# Altium schematic sheet CW6655H QFN48 BLE SDK V1.01.SchDoc
size A3; PageSetup: Record=PageOptions|CenterHorizontal=True|CenterVertical=True|PrintScale=0.69|XCorrection=1.00|YCorrection=1.00|PrintKind=0|BorderSize=5000000|LeftOffset=0|BottomOffset=0|Orientation=2|PaperLength=1000|PaperWidth=1000|Scale=100|PaperSource=7|PrintQuality=-4|MediaType=1|DitherType=10|PaperKind=A4|PrintScaleMode=1
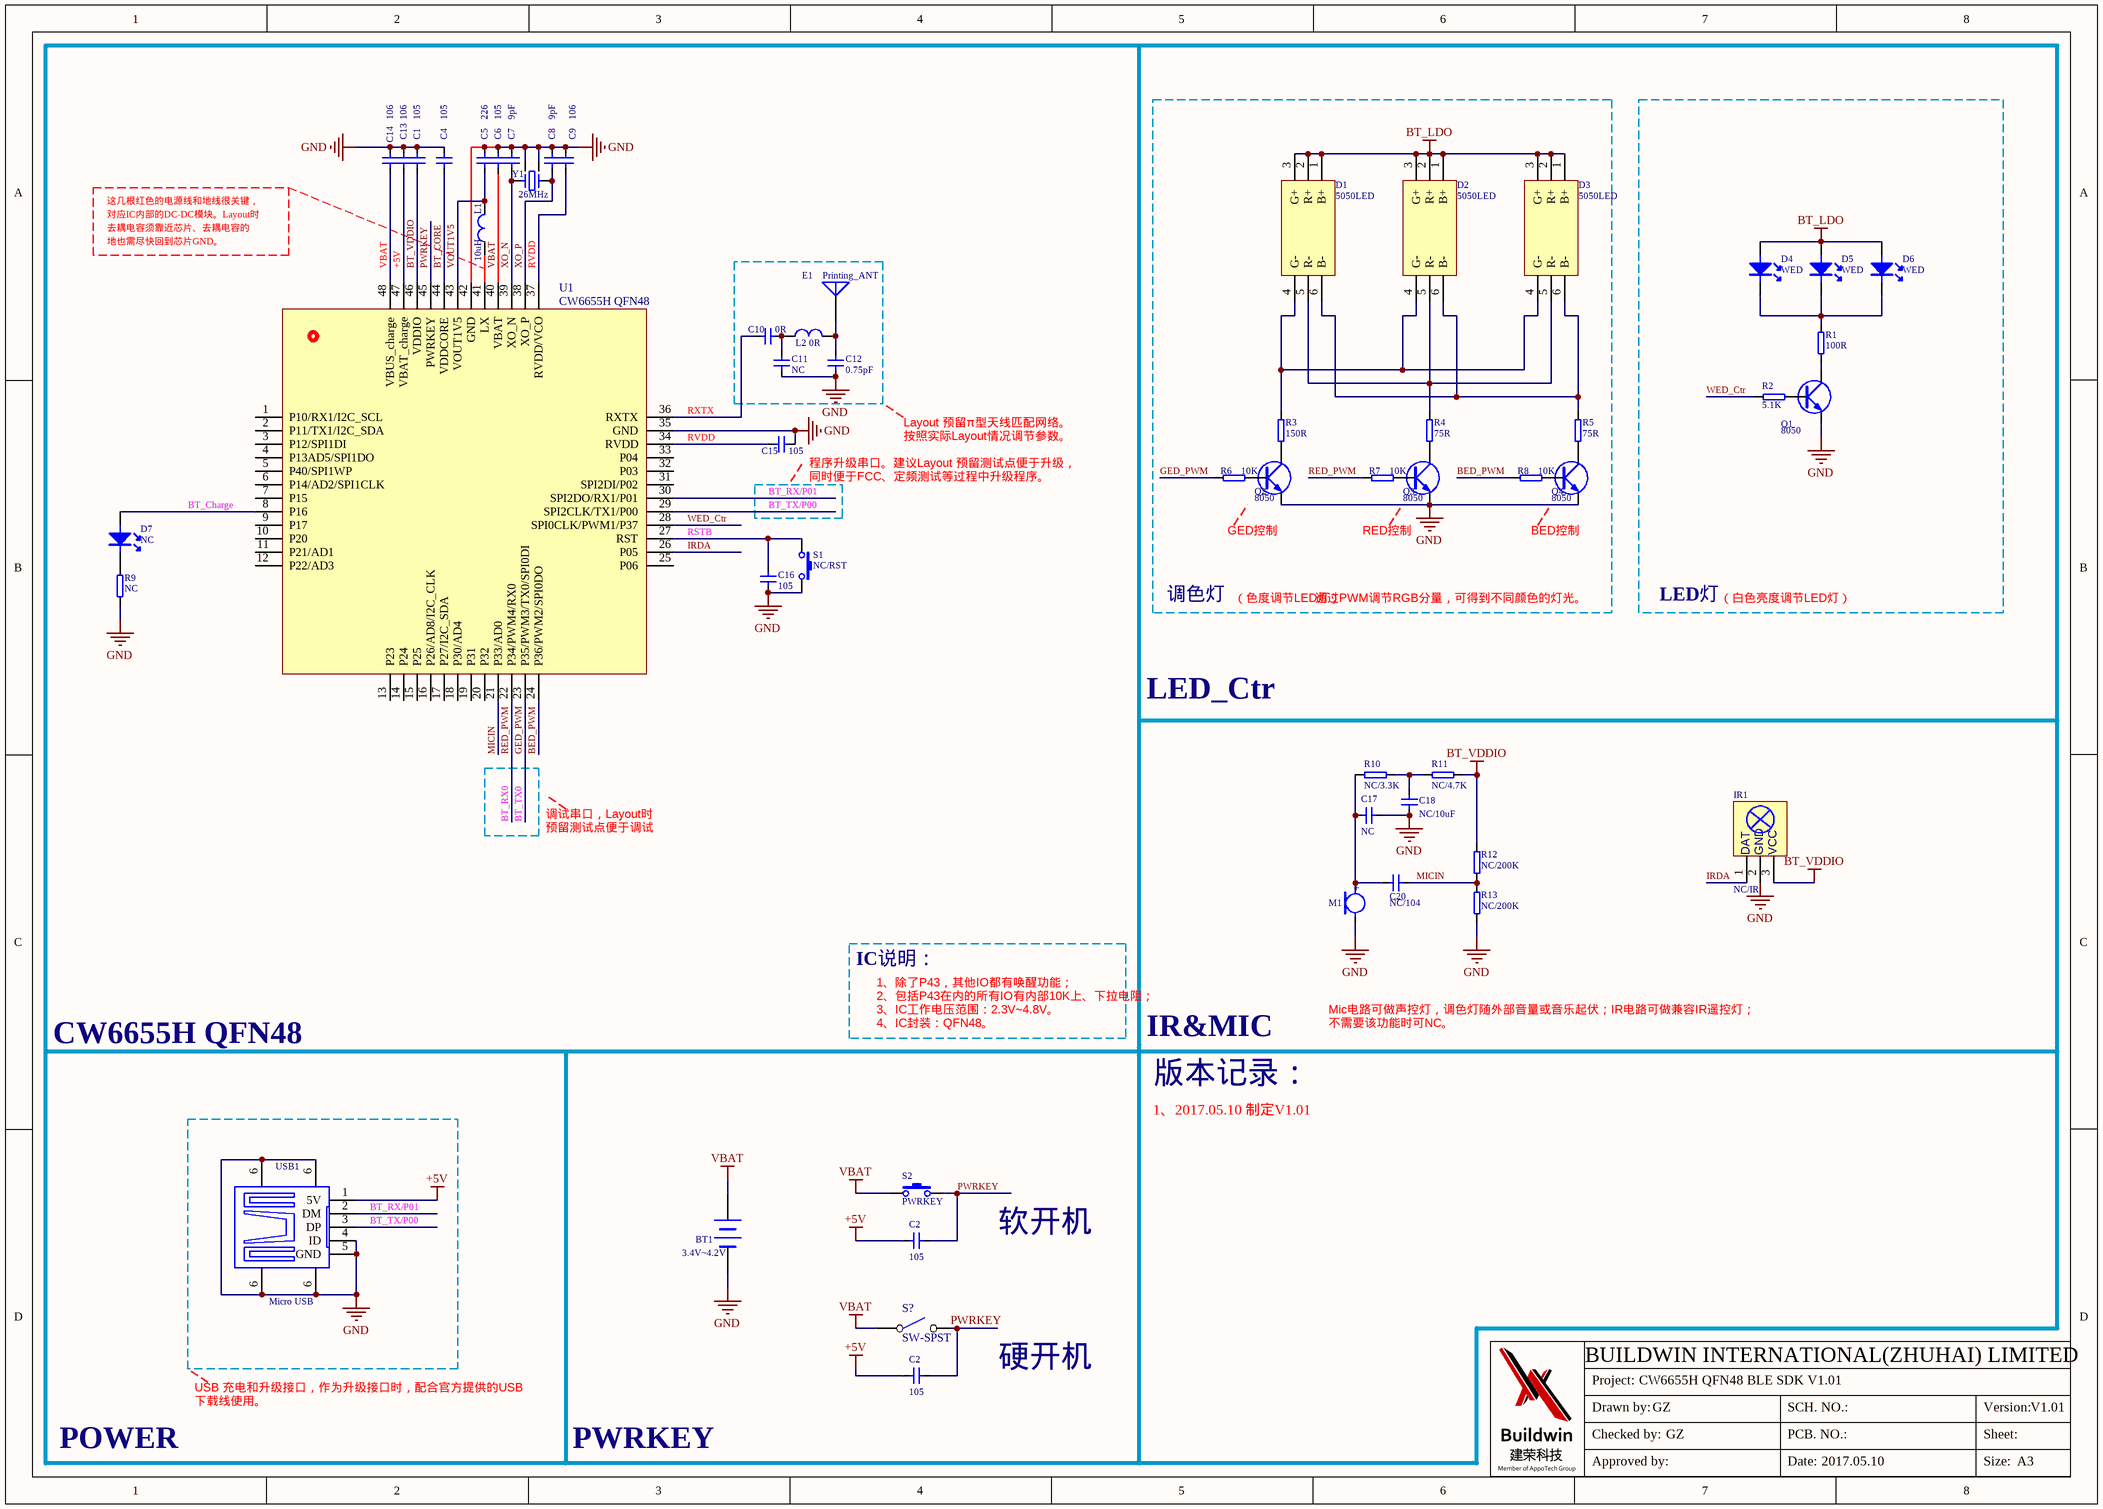
[diagram p0: CW6655H QFN48 BLE SDK V1.01.SchDoc]

## Parts
(Parts that share a designator on the sheet are numbered #1, #2 ... from top to bottom, then left to right.)
BT1  3.4V~4.2V  [SIP2]
C1  105  [C0603]
C2#1  105  [C0603]
C2#2  105  [C0603]
C4  105  [C0603]
C5  226  [C0805]
C6  105  [C0603]
C7  9pF  [C0402]
C8  9pF  [C0402]
C9  106  [C0603]
C10  0R  [C0402]
C11  NC  [C0402]
C12  0.75pF  [C0402]
C13  106  [C0603]
C14  106  [C0603]
C15  105  [C0603]
C16  105  [C0603]
C17  NC  [C0603]
C18  NC/10uF  [C0805]
C20  NC/104  [C0603]
D1  5050LED  [5050LED]
D2  5050LED  [5050LED]
D3  5050LED  [5050LED]
D4  WED  [D3528]
D5  WED  [D3528]
D6  WED  [D3528]
D7  NC  [d0805]
E1  Printing_ANT  [IFA]  (net tie, no BOM)
IR1  NC/IR  [IC-REM]
L1  10uH  [L0805]
L2  0R  [R0402]
M1  MIC  [MIC]  (value not drawn)
Q1  8050  [SOT-23]
Q2  8050  [SOT-23]
Q3  8050  [SOT-23]
Q4  8050  [SOT-23]
R1  100R  [R0603]
R2  5.1K  [R0603]
R3  150R  [R0603]
R4  75R  [R0603]
R5  75R  [R0603]
R6  10K  [R0603]
R7  10K  [R0603]
R8  10K  [R0603]
R9  NC  [R0603]
R10  NC/3.3K  [R0603]
R11  NC/4.7K  [R0603]
R12  NC/200K  [R0603]
R13  NC/200K  [R0603]
S1  NC/RST  [KEY_SMD_4.5*4.5]
S2  PWRKEY  [KEY_SMD_4.5*4.5]
S?  SW-SPST
U1  CW6655H QFN48  [QFN-48L-0.4]
USB1  Micro USB  [USB-MICRO]
Y1  26MHz  [26m]

## Blocks framed on the sheet
调色灯: D1-D3 Q2-Q4 R3-R8
LED灯: D4-D6 Q1 R1 R2

## Nets
+5V: C2#1.2 C2#2.2 C13.1 U1.47(VBAT_charge) USB1.1(5V)
BT_LDO: D1.1(B+) D1.2(R+) D1.3(G+) D2.1(B+) D2.2(R+) D2.3(G+) D3.1(B+) D3.2(R+) D3.3(G+) D4.1 D5.1 D6.1
BT_VDDIO: C1.2 IR1.3(VCC) R11.2 R12.2 U1.46(VDDIO)
GND: BT1.2(-) C1.1 C4.1 C5.1 C6.1 C7.1 C8.1 C9.1 C11.1 C12.1 C13.2 C14.2 C15.2 C16.1 C17.1 C18.1 IR1.2(GND) M1.2 Q1.2(E) Q2.2(E) Q3.2(E) Q4.2(E) R9.1 R13.1 S1.2 U1.35(GND) U1.42(GND) USB1.4(ID) USB1.5(GND) USB1.6 Y1.2 Y1.4
VBAT: BT1.1(+) C6.2 C14.1 S2.1 S?.1 U1.40(VBAT) U1.48(VBUS_charge)
BED_PWM: R8.2 U1.24(P36/PWM2/SPI0DO)
BT_Charge: D7.1 U1.8(P16)
BT_CORE: C4.2 U1.44(VDDCORE)
BT_RX0: R7.2 U1.22(P34/PWM4/RX0)  [also labelled RED_PWM]
BT_RX/P01: U1.30(SPI2DO/RX1/P01) USB1.2(DM)
BT_TX0: R6.2 U1.23(P35/PWM3/TX0/SPI0DI)  [also labelled GED_PWM]
BT_TX/P00: U1.29(SPI2CLK/TX1/P00) USB1.3(DP)
IRDA: IR1.1(DAT) U1.26(P05)
MICIN: C20.1 R12.1 R13.2 U1.21(P33/AD0)
PWRKEY: C2#1.1 C2#2.1 S2.2 S?.2 U1.45(PWRKEY)
RSTB: C16.2 S1.1 U1.27(RST)
RVDD: C9.2 C15.1 U1.34(RVDD) U1.37(RVDD/VCO)
RXTX: C10.1 U1.36(RXTX)
VOUT1V5: C5.2 L1.2 U1.43(VOUT1V5)
WED_Ctr: R2.2 U1.28(SPI0CLK/PWM1/P37)
XO_N: C7.2 U1.39(XO_N) Y1.3
XO_P: C8.2 U1.38(XO_P) Y1.1
NetC10_2: C10.2 C11.2 L2.1
NetC12_2: C12.2 E1.1(A) L2.2
NetC17_2: C17.2 C20.2 M1.1 R10.1
NetC18_2: C18.2 R10.2 R11.1
NetD1_4: D1.4(G-) D2.4(G-) D3.4(G-) R3.1
NetD1_5: D1.5(R-) D2.5(R-) D3.5(R-) R4.1
NetD1_6: D1.6(B-) D2.6(B-) D3.6(B-) R5.1
NetD4_2: D4.2 D5.2 D6.2 R1.2
NetD7_2: D7.2 R9.2
NetL1_1: L1.1 U1.41(LX)
NetQ1_1: Q1.1(B) R2.1
NetQ1_3: Q1.3(C) R1.1
NetQ2_1: Q2.1(B) R6.1
NetQ2_3: Q2.3(C) R3.2
NetQ3_1: Q3.1(B) R7.1
NetQ3_3: Q3.3(C) R4.2
NetQ4_1: Q4.1(B) R8.1
NetQ4_3: Q4.3(C) R5.2

Not connected (* = marked no-connect by the designer): U1 1(P10/RX1/I2C_SCL) 2(P11/TX1/I2C_SDA) 3(P12/SPI1DI) 4(P13AD5/SPI1DO) 5(P40/SPI1WP) 6(P14/AD2/SPI1CLK) 7(P15) 9(P17) 10(P20) 11(P21/AD1) 12(P22/AD3) 13(P23) 14(P24) 15(P25) 16(P26/AD8/I2C_CLK) 17(P27/I2C_SDA) 18(P30/AD4) 19(P31) 20(P32) 25(P06) 31(SPI2DI/P02) 32(P03) 33(P04)

## Notes on the sheet
- 这几根红色的电源线和地线很关键，
- 对应IC内部的DC-DC模块。Layout时
- 去耦电容须靠近芯片、去耦电容的
- 地也需尽快回到芯片GND。
- Layout 预留π型天线匹配网络。
- 按照实际Layout情况调节参数。
- (near C15) 程序升级串口。建议Layout 预留测试点便于升级，
- (near C15) 同时便于FCC、定频测试等过程中升级程序。
- GED控制
- RED控制
- BED控制
- （色度调节LED灯）
- 通过PWM调节RGB分量，可得到不同颜色的灯光。
- （白色亮度调节LED灯）
- LED_Ctr
- 调试串口，Layout时
- 预留测试点便于调试
- IC说明：
- 1、除了P43，其他IO都有唤醒功能；
- CW6655H QFN48
- 2、包括P43在内的所有IO有内部10K上、下拉电阻；
- 3、IC工作电压范围：2.3V~4.8V。
- 4、IC封装：QFN48。
- IR&MIC
- Mic电路可做声控灯，调色灯随外部音量或音乐起伏；IR电路可做兼容IR遥控灯；
- 不需要该功能时可NC。
- 版本记录：
- 1、2017.05.10 制定V1.01
- 软开机
- USB 充电和升级接口，作为升级接口时，配合官方提供的USB
- 硬开机
- BUILDWIN INTERNATIONAL(ZHUHAI) LIMITED
- Project:
- CW6655H QFN48 BLE SDK V1.01
- POWER
- 下载线使用。
- PWRKEY
- Drawn by:
- Checked by:
- GZ
- SCH. NO.:
- PCB. NO.:
- Version:
- Sheet:
- V1.01
- Approved by:
- Date:
- 2017.05.10
- Size:
- A3
- (in symbol MICROPHONE2) +

## Library data of the parts
BT1 = BATTERY
C1 C2#1 C2#2 C4-C18 C20 = CAP: Capacitor
D4-D7 = LED
E1 = Antenna: Generic Antenna; Published: 24-Mar-1999; LatestRevisionDate: 17-Jul-2002; LatestRevisionNote: Re-released for DXP Platform.; PackageReference: PIN1; Publisher: Altium Limited
IR1 = IR
L1 L2 = INDUCTOR
M1 = MICROPHONE2: Microphone
Q1-Q4 = NPN-SMD1: NPN Transistor
R1-R13 = RES2
S1 S2 = SW-PB
U1 = CW6655H
USB1 = Mini USB-F
Y1 = CRYSTAL